# Altium project VM03_hv5.PrjPcb
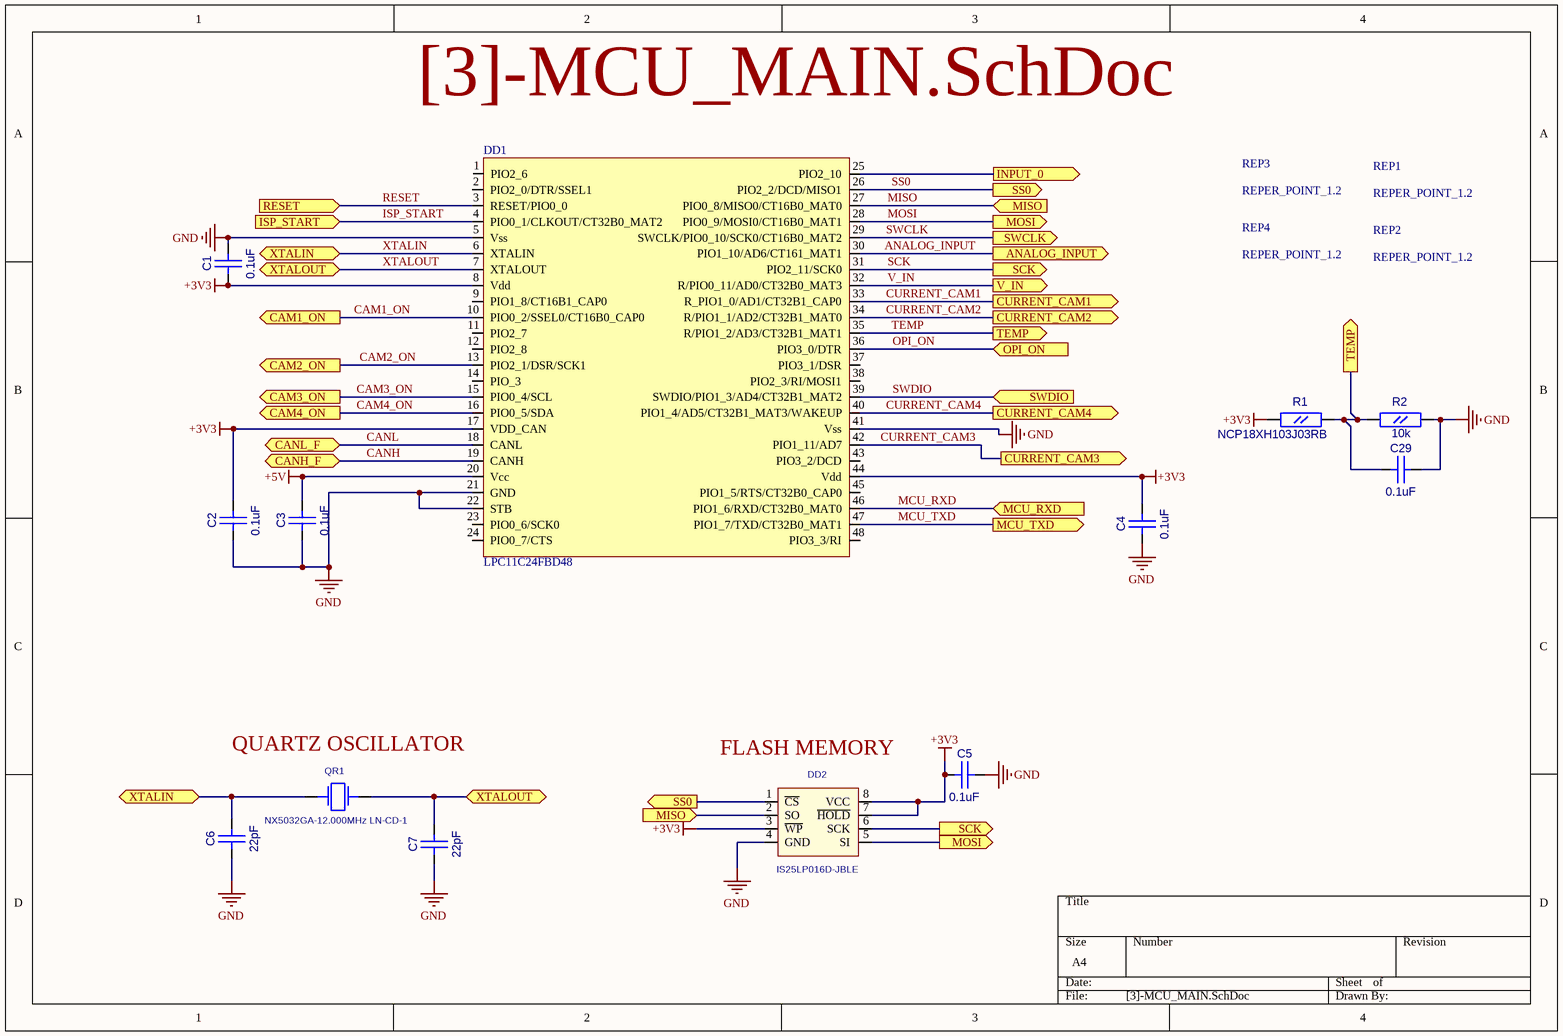
[diagram p0: [3]-MCU_MAIN.SchDoc]
7 sheets, 148 parts. Net scope: flat (ports and power ports of the same name join across sheets).
Board file: VM03_hv5.PcbDoc
Sheets:
  [3]-MCU_MAIN.SchDoc
  [6]-H3_MAIN.SchDoc
  [10]-MODEM_CONNECTORS.SchDoc
  [12]-CAMERA_POWER.SchDoc
  [16]-ETH_SWITCH.SchDoc
  [17]-ETH_CONNECTOR.SchDoc
  [19]-CAMERA_PWR_CONNECTORS.SchDoc

## Sheet [3]-MCU_MAIN.SchDoc
size A4

### Parts
C1  0.1uF  [CC0603]
C2  0.1uF  [CC0603]
C3  0.1uF  [CC0603]
C4  0.1uF  [CC0603]
C5  0.1uF  [CC0603]
C6  22pF  [CC0603]
C7  22pF  [CC0603]
C29  0.1uF  [CC0603]
DD1  LPC11C24FBD48  [LQFP48]
DD2  IS25LP016D-JBLE  [EIAJ_SO8]
QR1  NX5032GA-12.000MHz LN-CD-1  [AC5032_2]
R1  NCP18XH103J03RB  [RC0603]
R2  10k  [RC0603]
REP1  REPER_POINT_1.2  [REPER1.2]
REP2  REPER_POINT_1.2  [REPER1.2]
REP3  REPER_POINT_1.2  [REPER1.2]
REP4  REPER_POINT_1.2  [REPER1.2]

### Ports
ANALOG_INPUT (out), CAM1_ON (out), CAM2_ON (out), CAM3_ON (out), CAM4_ON (out), CANH_F (bidir), CANL_F (bidir), CURRENT_CAM1 (out), CURRENT_CAM2 (out), CURRENT_CAM3 (out), CURRENT_CAM4 (out), INPUT_0 (out), ISP_START (in), MCU_RXD (in), MCU_TXD (out), MISO (in), MOSI (out), OPI_ON (in), RESET (in), SCK (out), SS0 (out), SWCLK (out), SWDIO (in), TEMP (out), V_IN (out), XTALIN (bidir), XTALOUT (bidir)

### Nets
+3V3: C1.1(A) C2.2(B) C4.2(B) C5.1(A) DD1.8(Vdd) DD1.17(VDD_CAN) DD1.44(Vdd) DD2.3(~{WP}) DD2.7(~{HOLD}) DD2.8(VCC) R1.1(A)
+5V: C3.2(B) DD1.20(Vcc)
GND: C1.2(B) C2.1(A) C3.1(A) C4.1(A) C5.2(B) C6.1(A) C7.1(A) C29.2(B) DD1.5(Vss) DD1.21(GND) DD1.22(STB) DD1.41(Vss) DD2.4(GND) R2.2(B)
ANALOG_INPUT: DD1.30(PIO1_10/AD6/CT161_MAT1) ; port ANALOG_INPUT
CAM1_ON: DD1.10(PIO0_2/SSEL0/CT16B0_CAP0) ; port CAM1_ON
CAM2_ON: DD1.13(PIO2_1/DSR/SCK1) ; port CAM2_ON
CAM3_ON: DD1.15(PIO0_4/SCL) ; port CAM3_ON
CAM4_ON: DD1.16(PIO0_5/SDA) ; port CAM4_ON
CANH: DD1.19(CANH) ; port CANH_F
CANL: DD1.18(CANL) ; port CANL_F
CURRENT_CAM1: DD1.33(R_PIO1_0/AD1/CT32B1_CAP0) ; port CURRENT_CAM1
CURRENT_CAM2: DD1.34(R/PIO1_1/AD2/CT32B1_MAT0) ; port CURRENT_CAM2
CURRENT_CAM3: DD1.42(PIO1_11/AD7) ; port CURRENT_CAM3
CURRENT_CAM4: DD1.40(PIO1_4/AD5/CT32B1_MAT3/WAKEUP) ; port CURRENT_CAM4
INPUT_0: DD1.25(PIO2_10) ; port INPUT_0
ISP_START: DD1.4(PIO0_1/CLKOUT/CT32B0_MAT2) ; port ISP_START
MCU_RXD: DD1.46(PIO1_6/RXD/CT32B0_MAT0) ; port MCU_RXD
MCU_TXD: DD1.47(PIO1_7/TXD/CT32B0_MAT1) ; port MCU_TXD
MISO: DD1.27(PIO0_8/MISO0/CT16B0_MAT0) DD2.2(SO) ; port MISO
MOSI: DD1.28(PIO0_9/MOSI0/CT16B0_MAT1) DD2.5(SI) ; port MOSI
OPI_ON: DD1.36(PIO3_0/DTR) ; port OPI_ON
RESET: DD1.3(RESET/PIO0_0) ; port RESET
SCK: DD1.31(PIO2_11/SCK0) DD2.6(SCK) ; port SCK
SS0: DD1.26(PIO2_2/DCD/MISO1) DD2.1(~{CS}) ; port SS0
SWCLK: DD1.29(SWCLK/PIO0_10/SCK0/CT16B0_MAT2) ; port SWCLK
SWDIO: DD1.39(SWDIO/PIO1_3/AD4/CT32B1_MAT2) ; port SWDIO
TEMP: C29.1(A) DD1.35(R/PIO1_2/AD3/CT32B1_MAT1) R1.2(B) R2.1(A) ; port TEMP
V_IN: DD1.32(R/PIO0_11/AD0/CT32B0_MAT3) ; port V_IN
XTALIN: C6.2(B) DD1.6(XTALIN) QR1.1 ; port XTALIN
XTALOUT: C7.2(B) DD1.7(XTALOUT) QR1.2 ; port XTALOUT

Not connected (* = marked no-connect by the designer): DD1 1(PIO2_6) 2(PIO2_0/DTR/SSEL1) 9(PIO1_8/CT16B1_CAP0) 11(PIO2_7) 12(PIO2_8) 14(PIO_3) 23(PIO0_6/SCK0) 24(PIO0_7/CTS) 37(PIO3_1/DSR) 38(PIO2_3/RI/MOSI1) 43(PIO3_2/DCD) 45(PIO1_5/RTS/CT32B0_CAP0) 48(PIO3_3/RI); REP1 1; REP2 1; REP3 1; REP4 1

### Notes on the sheet
- (near QR1) QUARTZ OSCILLATOR
- (near DD2) FLASH MEMORY

### Library data of the parts
C1-C7 C29 = CC0603
  C1-C5 C29: Value: 0.1uF
  C6 C7: Value: 22pF
DD2 = S25FL016A0LMFI01: Value: IS25LP016D-JBLE
QR1 = AC5032_2: AC5032/2; Value: NX5032GA-12.000MHz LN-CD-1
R1 R2 = RC0603
  R1: Value: NCP18XH103J03RB
  R2: Value: 10k
REP1-REP4 = REPER1.2: Value: REPER_POINT_1.2
DD1 = LPC11C24FBD48: Value: LPC11C24FBD48

## Sheet [6]-H3_MAIN.SchDoc
size A4
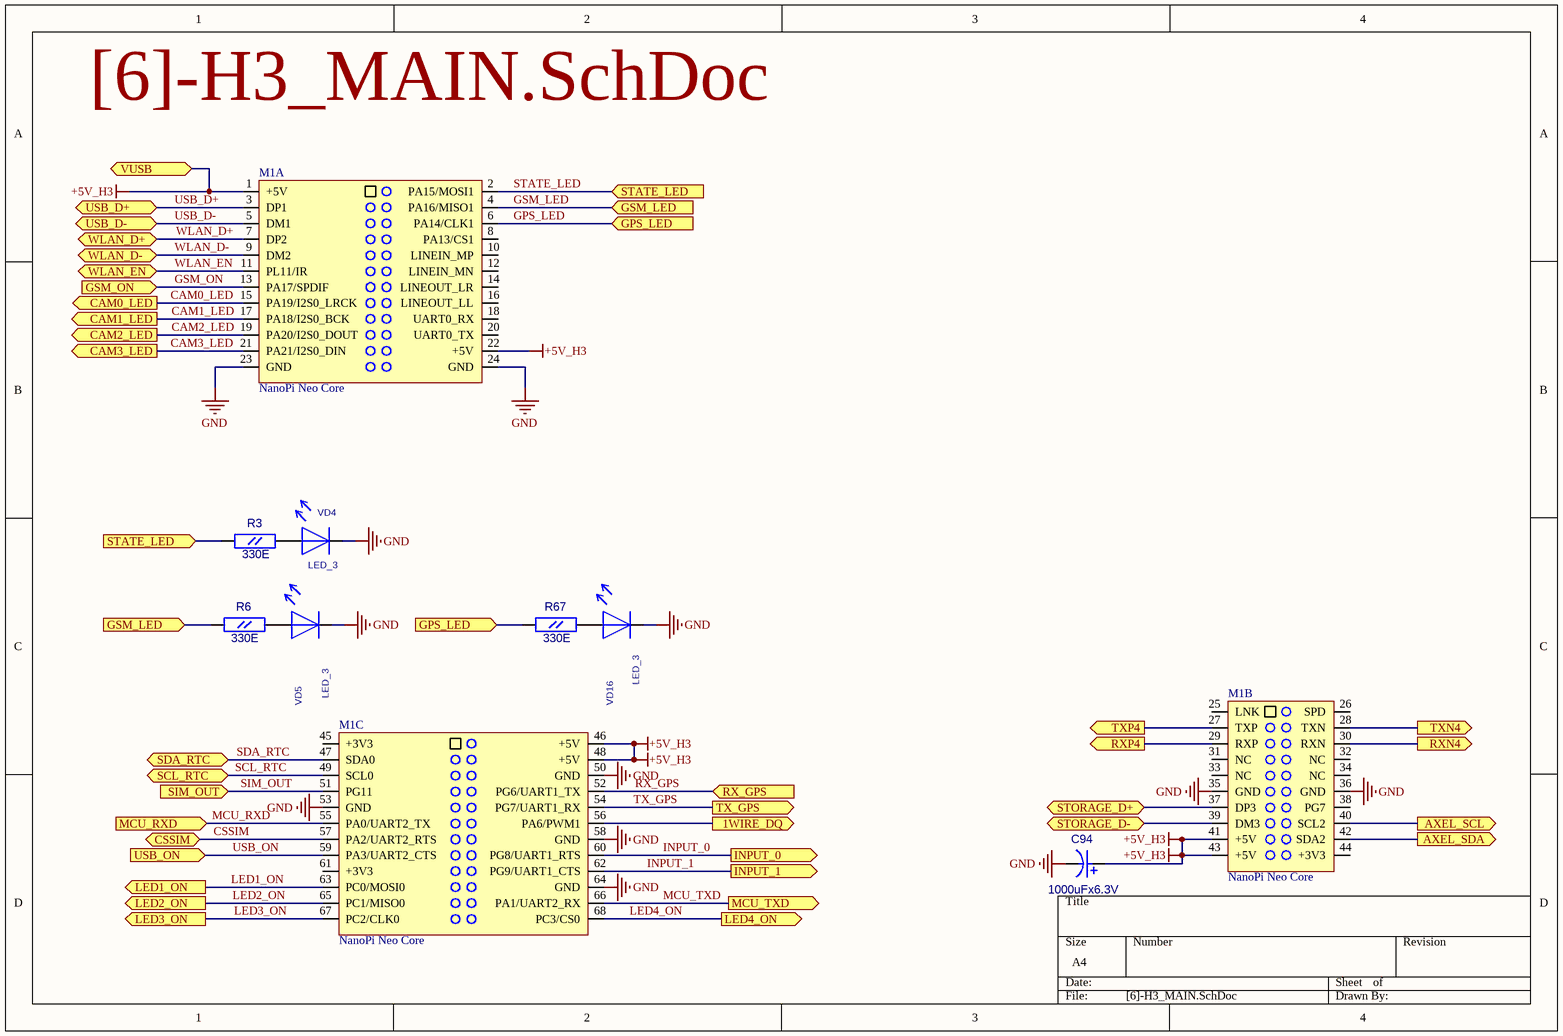
[diagram p1: [6]-H3_MAIN.SchDoc]

### Parts
C94  1000uFx6.3V  [CC8X3.5]
M1  NanoPi Neo Core  [NanoPiNeo_CORE]  (parts A,B,C of 3)
R3  330E  [RC0603]
R6  330E  [RC0603]
R67  330E  [RC0603]
VD4  LED_3  [LED3]
VD5  LED_3  [LED3]
VD16  LED_3  [LED3]

### Ports
1WIRE_DQ (out), AXEL_SCL (out), AXEL_SDA (out), CAM0_LED (out), CAM1_LED (out), CAM2_LED (out), CAM3_LED (out), CSSIM (bidir), GPS_LED (in), GSM_LED (in), GSM_ON (in), INPUT_0 (out), INPUT_1 (out), LED1_ON (out), LED2_ON (out), LED3_ON (out), LED4_ON (out), MCU_RXD (in), MCU_TXD (out), RX_GPS (in), RXN4 (out), RXP4 (out), SCL_RTC (bidir), SDA_RTC (bidir), SIM_OUT (in), STATE_LED (in), STORAGE_D+ (bidir), STORAGE_D- (bidir), TX_GPS (out), TXN4 (out), TXP4 (out), USB_D+ (bidir), USB_D- (bidir), USB_ON (in), VUSB (bidir), WLAN_D+ (bidir), WLAN_D- (bidir), WLAN_EN (bidir)

### Nets
+5V_H3: C94.1 M1.1(+5V) M1.22(+5V) M1.41(+5V) M1.43(+5V) M1.46(+5V) M1.48(+5V) ; port VUSB
GND: C94.2 M1.23(GND) M1.24(GND) M1.35(GND) M1.36(GND) M1.50(GND) M1.53(GND) M1.58(GND) M1.64(GND) VD4.1 VD5.1 VD16.1
CAM0_LED: M1.15(PA19/I2S0_LRCK) ; port CAM0_LED
CAM1_LED: M1.17(PA18/I2S0_BCK) ; port CAM1_LED
CAM2_LED: M1.19(PA20/I2S0_DOUT) ; port CAM2_LED
CAM3_LED: M1.21(PA21/I2S0_DIN) ; port CAM3_LED
CSSIM: M1.57(PA2/UART2_RTS) ; port CSSIM
GPS_LED: M1.6(PA14/CLK1) R67.1(A) ; port GPS_LED
GSM_LED: M1.4(PA16/MISO1) R6.1(A) ; port GSM_LED
GSM_ON: M1.13(PA17/SPDIF) ; port GSM_ON
INPUT_0: M1.60(PG8/UART1_RTS) ; port INPUT_0
INPUT_1: M1.62(PG9/UART1_CTS) ; port INPUT_1
LED1_ON: M1.63(PC0/MOSI0) ; port LED1_ON
LED2_ON: M1.65(PC1/MISO0) ; port LED2_ON
LED3_ON: M1.67(PC2/CLK0) ; port LED3_ON
LED4_ON: M1.68(PC3/CS0) ; port LED4_ON
MCU_RXD: M1.55(PA0/UART2_TX) ; port MCU_RXD
MCU_TXD: M1.66(PA1/UART2_RX) ; port MCU_TXD
RX_GPS: M1.52(PG6/UART1_TX) ; port RX_GPS
SCL_RTC: M1.49(SCL0) ; port SCL_RTC
SDA_RTC: M1.47(SDA0) ; port SDA_RTC
SIM_OUT: M1.51(PG11) ; port SIM_OUT
STATE_LED: M1.2(PA15/MOSI1) R3.1(A) ; port STATE_LED
TX_GPS: M1.54(PG7/UART1_RX) ; port TX_GPS
USB_D+: M1.3(DP1) ; port USB_D+
USB_D-: M1.5(DM1) ; port USB_D-
USB_ON: M1.59(PA3/UART2_CTS) ; port USB_ON
WLAN_D+: M1.7(DP2) ; port WLAN_D+
WLAN_D-: M1.9(DM2) ; port WLAN_D-
WLAN_EN: M1.11(PL11/IR) ; port WLAN_EN
NetDD4_19: M1.27(TXP) ; port TXP4
NetDD4_20: M1.28(TXN) ; port TXN4
NetDD4_21: M1.30(RXN) ; port RXN4
NetDD4_22: M1.29(RXP) ; port RXP4
NetM1_37: M1.37(DP3) ; port STORAGE_D+
NetM1_39: M1.39(DM3) ; port STORAGE_D-
NetM1_40: M1.40(SCL2) ; port AXEL_SCL
NetM1_42: M1.42(SDA2) ; port AXEL_SDA
NetM1_56: M1.56(PA6/PWM1) ; port 1WIRE_DQ
NetR3_2: R3.2(B) VD4.2
NetR6_2: R6.2(B) VD5.2
NetR67_2: R67.2(B) VD16.2

Not connected (* = marked no-connect by the designer): M1 8(PA13/CS1) 10(LINEIN_MP) 12(LINEIN_MN) 14(LINEOUT_LR) 16(LINEOUT_LL) 18(UART0_RX) 20(UART0_TX) 25(LNK) 26(SPD) 31(NC) 32(NC) 33(NC) 34(NC) 38(PG7) 44(+3V3) 45(+3V3) 61(+3V3)

### Library data of the parts
C94 = CAP_8mm: Radial capacitor; Value: 1000uFx6.3V
M1 = NanoPi Neo Core: Nano Pi Neo Core Allwinner H3 based embedded module; Value: NanoPi Neo Core
R3 R6 R67 = RC0603: Value: 330E
VD4 VD5 VD16 = LED_3: Value: *

## Sheet [10]-MODEM_CONNECTORS.SchDoc
size A4
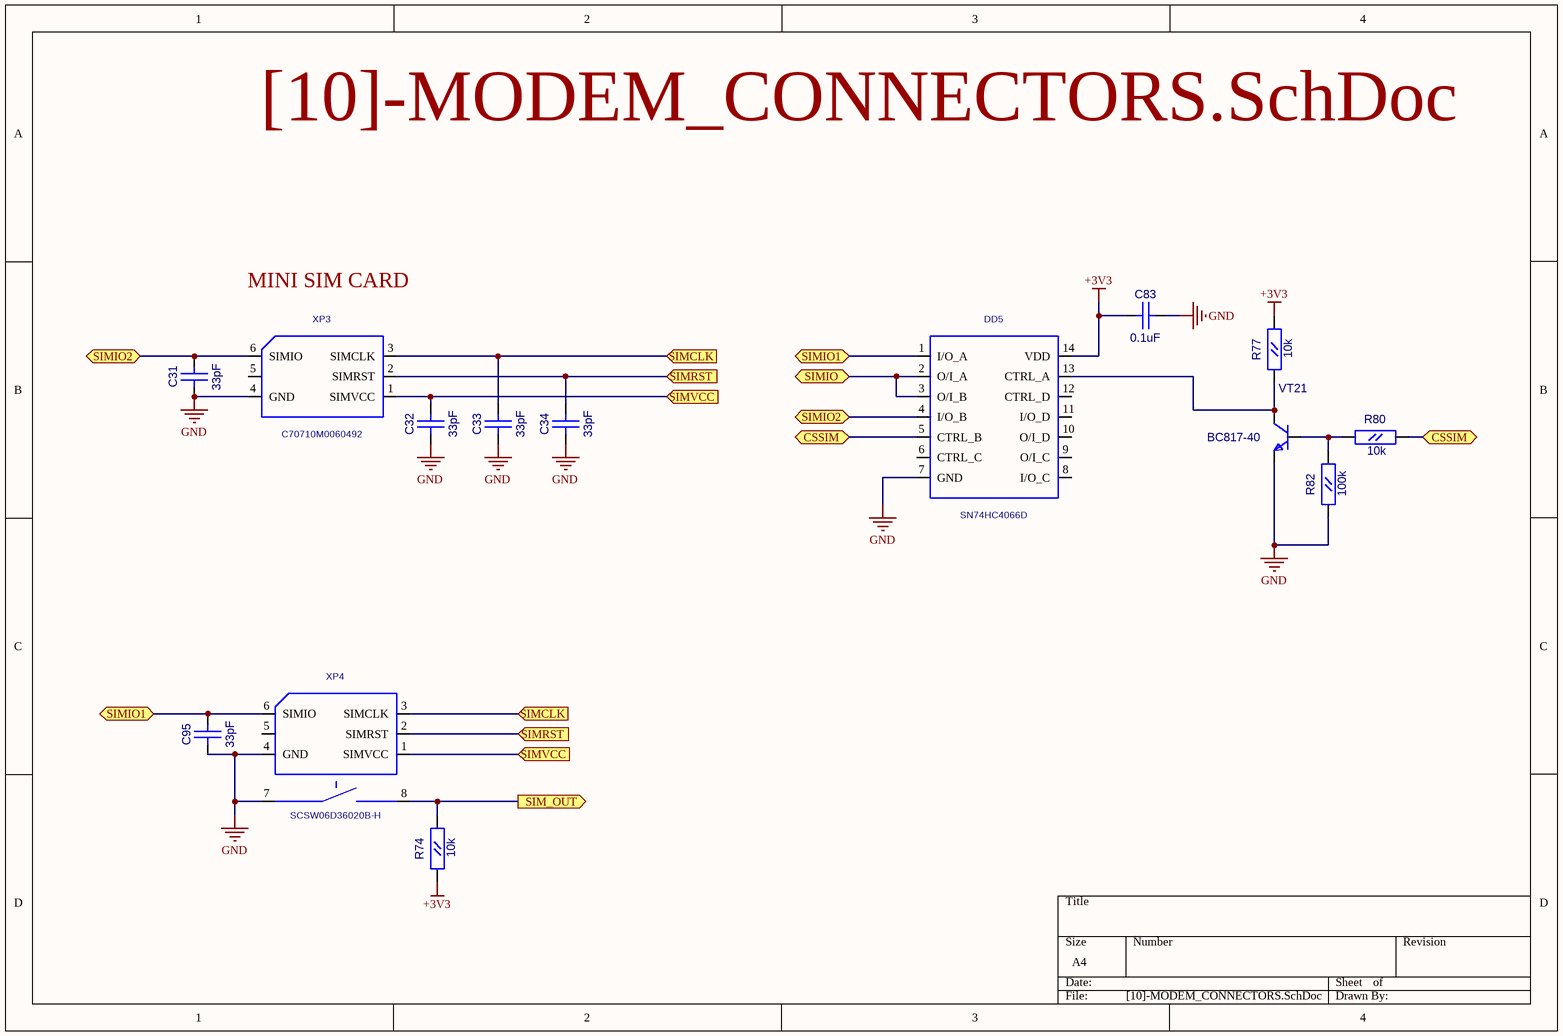
[diagram p2: [10]-MODEM_CONNECTORS.SchDoc]

### Parts
C31  33pF  [CC0603]
C32  33pF  [CC0603]
C33  33pF  [CC0603]
C34  33pF  [CC0603]
C83  0.1uF  [CC0603]
C95  33pF  [CC0603]
DD5  SN74HC4066D  [SO14]
R74  10k  [RC0603]
R77  10k  [RC0603]
R80  10k  [RC0603]
R82  100k  [RC0603]
VT21  BC817-40  [SOT-23(123)]
XP3  C70710M0060492  [SCVW06A25020]
XP4  SCSW06D36020B-H  [SCSW06D36020B-H]

### Ports
CSSIM (bidir), SIM_OUT (out), SIMCLK (in), SIMIO1 (bidir), SIMIO2 (bidir), SIMIO (bidir), SIMRST (in), SIMVCC (in)

### Nets
+3V3: C83.1(A) DD5.14(VDD) R74.1(A) R77.2(B)
GND: C31.1(A) C32.1(A) C33.1(A) C34.1(A) C83.2(B) C95.1(A) DD5.7(GND) R82.1(A) VT21.2(E) XP3.4(GND) XP4.4(GND) XP4.7
CSSIM: DD5.5(CTRL_B) R80.2(B) ; port CSSIM
SIM_OUT: R74.2(B) XP4.8 ; port SIM_OUT
NetC31_2: C31.2(B) DD5.4(I/O_B) XP3.6(SIMIO) ; port SIMIO2
NetC32_2: C32.2(B) XP3.1(SIMVCC) XP4.1(SIMVCC) ; port SIMVCC
NetC33_2: C33.2(B) XP3.3(SIMCLK) XP4.3(SIMCLK) ; port SIMCLK
NetC34_2: C34.2(B) XP3.2(SIMRST) XP4.2(SIMRST) ; port SIMRST
NetC95_2: C95.2(B) DD5.1(I/O_A) XP4.6(SIMIO) ; port SIMIO1
NetDD5_2: DD5.2(O/I_A) DD5.3(O/I_B) ; port SIMIO
NetDD5_13: DD5.13(CTRL_A) R77.1(A) VT21.3(C)
NetR80_1: R80.1(A) R82.2(B) VT21.1(B)

Not connected (* = marked no-connect by the designer): DD5 6(CTRL_C) 8(I/O_C) 9(O/I_C) 10(O/I_D) 11(I/O_D) 12(CTRL_D); XP3 5; XP4 5

### Notes on the sheet
- MINI SIM CARD

### Library data of the parts
C31-C34 C83 C95 = CC0603
  C31-C34 C95: Value: 33pF
  C83: Value: 0.1uF
R74 R77 R80 R82 = RC0603
  R74 R77 R80: Value: 10k
  R82: Value: 100k
VT21 = BC846BLT1: NPN 500ma transistor; ComponentField7: Published 29-Sep-2000; OriginalName: BC846BLT1; Value: BC817-40
XP3 = SCV-W06A25-020: Value: *
DD5 = SN74HC4066D: Value: *
XP4 = SCSW06D36020B-H: Value: *

## Sheet [12]-CAMERA_POWER.SchDoc
size A4
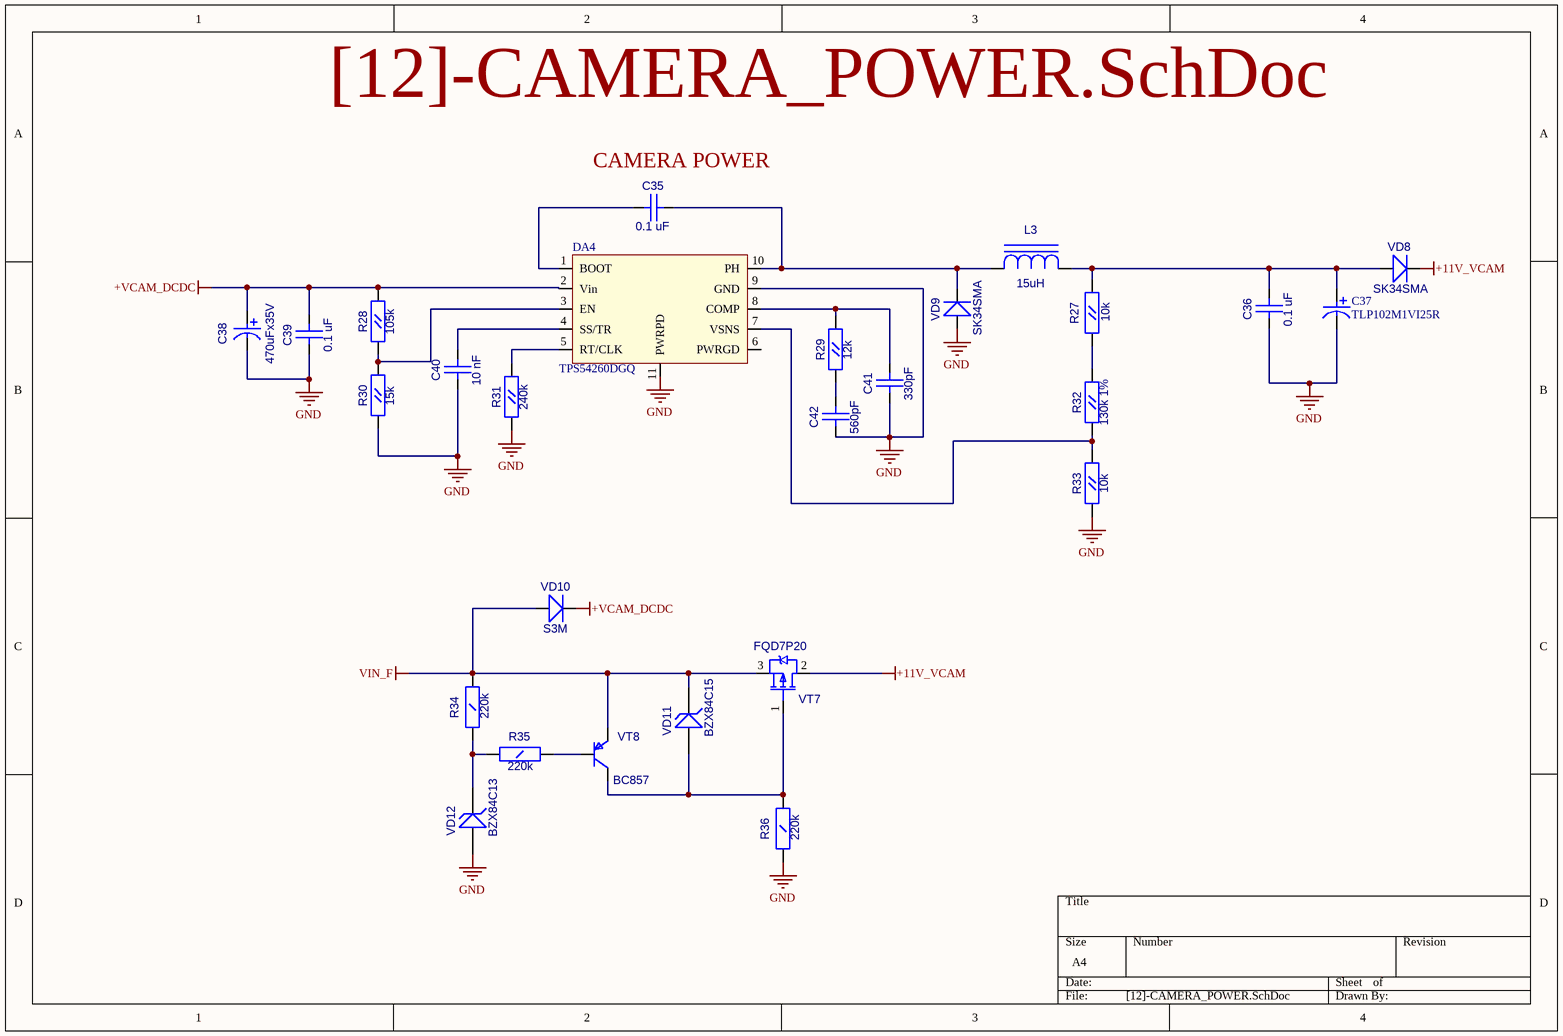
[diagram p3: [12]-CAMERA_POWER.SchDoc]

### Parts
C35  0.1 uF  [CC0603]
C36  0.1 uF  [CC0603]
C37  TLP102M1VI25R  [CAP_13x26]
C38  470uFx35V  [CC16X10_CAP0.5(1)(Primary)]
C39  0.1 uF  [CC0603]
C40  10 nF  [CC0603]
C41  330pF  [CC0603]
C42  560pF  [CC0603]
DA4  TPS54260DGQ  [S-PDSO-G10]
L3  15uH  [SDR0805]
R27  10k  [RC0603]
R28  105k  [RC0603]
R29  12k  [RC0603]
R30  15k  [RC0603]
R31  240k  [RC0603]
R32  130k 1%  [RC0603]
R33  10k  [RC0603]
R34  220k  [RC1206]
R35  220k  [RC1206]
R36  220k  [RC1206]
VD8  SK34SMA  [SMA]
VD9  SK34SMA  [SMA]
VD10  S3M  [SMC]
VD11  BZX84C15  [SOT-23(123)]
VD12  BZX84C13  [SOT-23(123)]
VT7  FQD7P20  [D-PAK(TO-252AA)]
VT8  BC857  [SOT-23(123)]

### Nets
+11V_VCAM: VD8.2(K) VT7.2(D)
+VCAM_DCDC: C38.2 C39.1(A) DA4.2(Vin) R28.2(B) VD10.2(K)
GND: C36.2(B) C37.1 C38.1 C39.2(B) C40.2(B) C41.2(B) C42.2(B) DA4.9(GND) DA4.11(PWRPD) R30.1(A) R31.1(A) R33.1(A) R36.1(A) VD9.1(A) VD12.1(A)
VIN_F: R34.2(B) VD10.1(A) VD11.3(K) VT7.3(S) VT8.2(E)
NetC35_1: C35.1(A) DA4.10(PH) L3.1(C) VD9.2(K)
NetC35_2: C35.2(B) DA4.1(BOOT)
NetC36_1: C36.1(A) C37.2 L3.2(A) R27.2(B) VD8.1(A)
NetC40_1: C40.1(A) DA4.4(SS/TR)
NetC41_1: C41.1(A) DA4.8(COMP) R29.2(B)
NetC42_1: C42.1(A) R29.1(A)
NetDA4_3: DA4.3(EN) R28.1(A) R30.2(B)
NetDA4_5: DA4.5(RT/CLK) R31.2(B)
NetDA4_7: DA4.7(VSNS) R32.1(A) R33.2(B)
NetR27_1: R27.1(A) R32.2(B)
NetR34_1: R34.1(A) R35.1(A) VD12.3(K)
NetR35_2: R35.2(B) VT8.1(B)
NetR36_2: R36.2(B) VD11.1(A) VT7.1(G) VT8.3(C)

Not connected (* = marked no-connect by the designer): DA4 6(PWRGD)

### Notes on the sheet
- (near C35) CAMERA POWER

### Library data of the parts
C35 C36 C39-C42 = CC0603
  C35 C36 C39: Value: 0.1 uF
  C40: Value: 10 nF
  C41: Value: 330pF
  C42: Value: 560pF
C37 = SUPERCAP_10F: Value: TLP102M1VI25R
C38 = CAP0.5(1): Value: 470uFx35V
L3 = SDR0805: Value: 15uH
R27-R33 = RC0603
  R27 R33: Value: 10k
  R28: Value: 105k
  R29: Value: 12k
  R30: Value: 15k
  R31: Value: 240k
  R32: Value: 130k 1%
R34-R36 = RC1206: Value: 220k
VD8 VD9 = SK34SMA: Schottky Rectifier; Value: {Value}
VD10 = S3A: Schottky Rectifier; Value: S3M
VD11 VD12 = BZX84: Zener Voltage Regulator Diode
  VD11: Value: BZX84C15
  VD12: Value: BZX84C13
VT7 = IRFR9220: HEXFET Power MOSFET; OriginalName: IRLML5103; ComponentField7: Published 8-Jun-2000; Value: FQD7P20
VT8 = BC857B: PNP 100ma transistor; OriginalName: BC846BLT1; ComponentField7: Published 29-Sep-2000; Value: BC857

## Sheet [16]-ETH_SWITCH.SchDoc
size A4
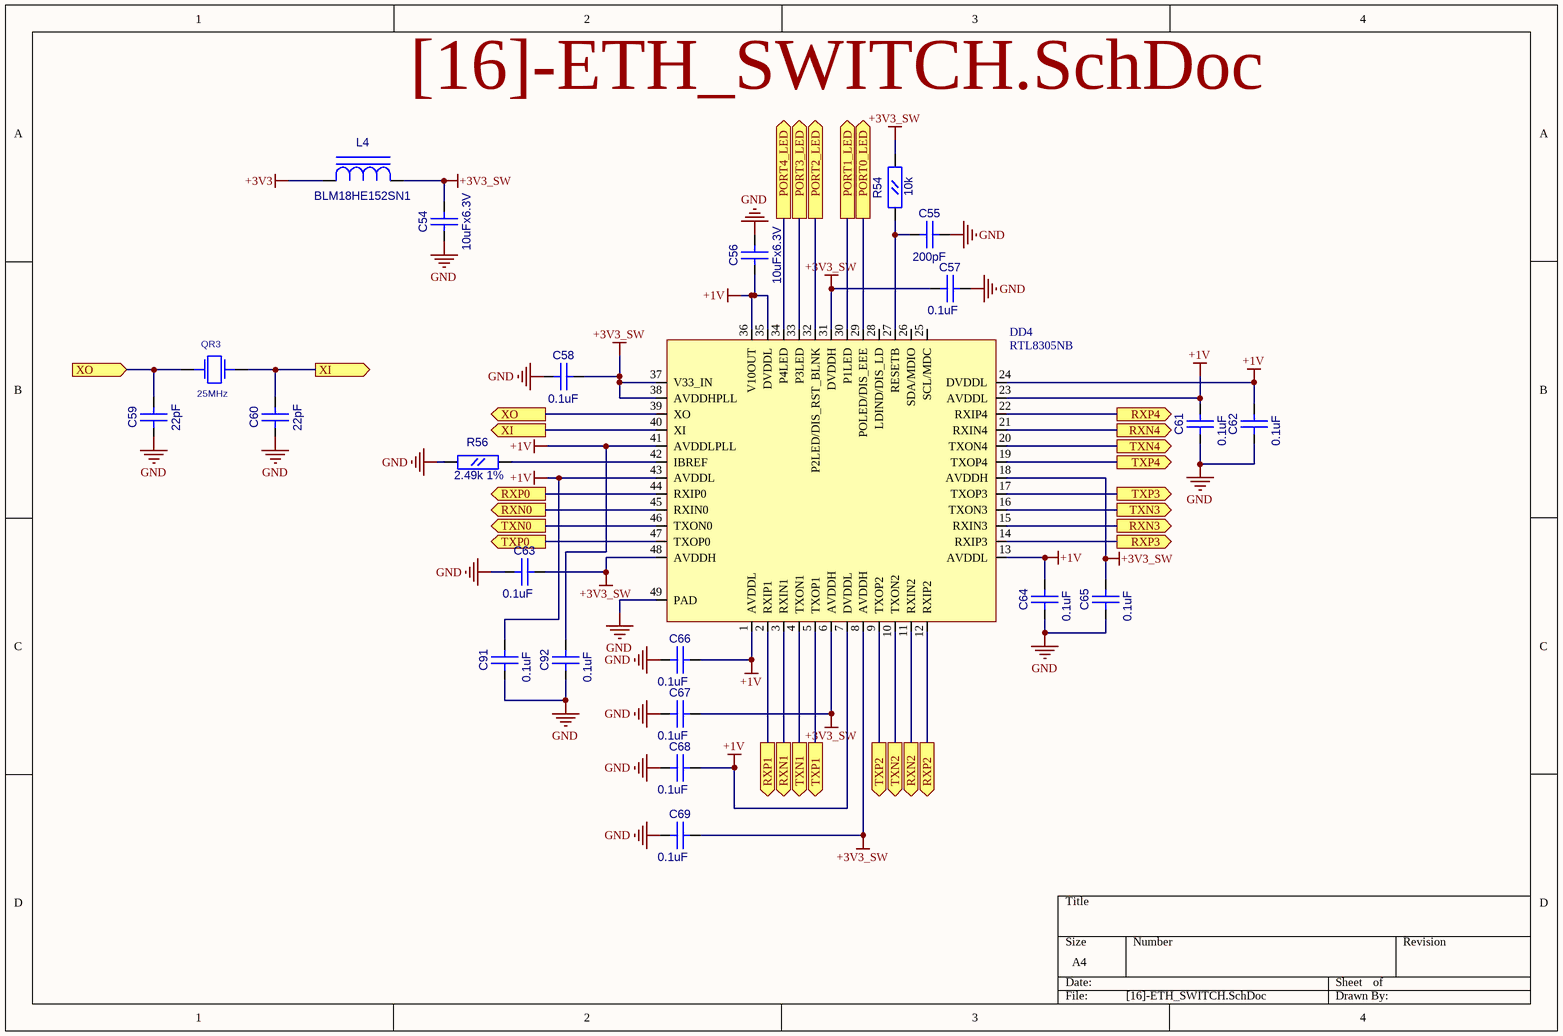
[diagram p4: [16]-ETH_SWITCH.SchDoc]

### Parts
C54  10uFx6.3V  [CC0805]
C55  200pF  [CC0603]
C56  10uFx6.3V  [CC0805]
C57  0.1uF  [CC0603]
C58  0.1uF  [CC0603]
C59  22pF  [CC0603]
C60  22pF  [CC0603]
C61  0.1uF  [CC0603]
C62  0.1uF  [CC0603]
C63  0.1uF  [CC0603]
C64  0.1uF  [CC0603]
C65  0.1uF  [CC0603]
C66  0.1uF  [CC0603]
C67  0.1uF  [CC0603]
C68  0.1uF  [CC0603]
C69  0.1uF  [CC0603]
C91  0.1uF  [CC0603]
C92  0.1uF  [CC0603]
DD4  RTL8305NB  [QFN48_ISL]
L4  BLM18HE152SN1  [L0603]
QR3  25MHz  [AC5032_2]
R54  10k  [RC0603]
R56  2.49k 1%  [RC0603]

### Ports
PORT0_LED (out), PORT1_LED (out), PORT2_LED (out), PORT3_LED (out), PORT4_LED (out), RXN0 (out), RXN1 (out), RXN2 (out), RXN3 (out), RXN4 (out), RXP0 (out), RXP1 (out), RXP2 (out), RXP3 (out), RXP4 (out), TXN0 (out), TXN1 (out), TXN2 (out), TXN3 (out), TXN4 (out), TXP0 (out), TXP1 (out), TXP2 (out), TXP3 (out), TXP4 (out), XI (out), XO (in), XO (out)

### Nets
+1V: C56.1(A) C61.2(B) C62.2(B) C64.2(B) C66.2(B) C68.2(B) C91.2(B) C92.2(B) DD4.1(AVDDL) DD4.7(DVDDL) DD4.13(AVDDL) DD4.23(AVDDL) DD4.24(DVDDL) DD4.35(DVDDL) DD4.36(V10OUT) DD4.41(AVDDLPLL) DD4.43(AVDDL)
+3V3: L4.1(A)
+3V3_SW: C54.2(B) C57.1(A) C58.2(B) C63.2(B) C65.2(B) C67.2(B) C69.2(B) DD4.6(AVDDH) DD4.8(AVDDH) DD4.18(AVDDH) DD4.31(DVDDH) DD4.37(V33_IN) DD4.38(AVDDHPLL) DD4.48(AVDDH) L4.2(C) R54.2(B)
GND: C54.1(A) C55.2(B) C56.2(B) C57.2(B) C58.1(A) C59.1(A) C60.1(A) C61.1(A) C62.1(A) C63.1(A) C64.1(A) C65.1(A) C66.1(A) C67.1(A) C68.1(A) C69.1(A) C91.1(A) C92.1(A) DD4.49(PAD) R56.1(A)
NetC55_1: C55.1(A) DD4.27(RESETB) R54.1(A)
NetC59_2: C59.2(B) DD4.39(XO) QR3.1 ; port XO
NetC60_2: C60.2(B) DD4.40(XI) QR3.2 ; port XI
NetDD4_2: DD4.2(RXIP1) ; port RXP1
NetDD4_3: DD4.3(RXIN1) ; port RXN1
NetDD4_4: DD4.4(TXON1) ; port TXN1
NetDD4_5: DD4.5(TXOP1) ; port TXP1
NetDD4_9: DD4.9(TXOP2) ; port TXP2
NetDD4_10: DD4.10(TXON2) ; port TXN2
NetDD4_11: DD4.11(RXIN2) ; port RXN2
NetDD4_12: DD4.12(RXIP2) ; port RXP2
NetDD4_14: DD4.14(RXIP3) ; port RXP3
NetDD4_15: DD4.15(RXIN3) ; port RXN3
NetDD4_16: DD4.16(TXON3) ; port TXN3
NetDD4_17: DD4.17(TXOP3) ; port TXP3
NetDD4_19: DD4.19(TXOP4) ; port TXP4
NetDD4_20: DD4.20(TXON4) ; port TXN4
NetDD4_21: DD4.21(RXIN4) ; port RXN4
NetDD4_22: DD4.22(RXIP4) ; port RXP4
NetDD4_29: DD4.29(POLED/DIS_EEE) ; port PORT0_LED
NetDD4_30: DD4.30(P1LED) ; port PORT1_LED
NetDD4_32: DD4.32(P2LED/DIS_RST_BLNK) ; port PORT2_LED
NetDD4_33: DD4.33(P3LED) ; port PORT3_LED
NetDD4_34: DD4.34(P4LED) ; port PORT4_LED
NetDD4_42: DD4.42(IBREF) R56.2(B)
NetDD4_44: DD4.44(RXIP0) ; port RXP0
NetDD4_45: DD4.45(RXIN0) ; port RXN0
NetDD4_46: DD4.46(TXON0) ; port TXN0
NetDD4_47: DD4.47(TXOP0) ; port TXP0

Not connected (* = marked no-connect by the designer): DD4 25(SCL/MDC) 26(SDA/MDIO) 28(LDIND/DIS_LD)

### Library data of the parts
C54 C56 = CC0805: Value: 10uFx6.3V
C55 C57-C69 C91 C92 = CC0603
  C55: Value: 200pF
  C57 C58 C61-C69 C91 C92: Value: 0.1uF
  C59 C60: Value: 22pF
L4 = L0603: Value: BLM18HE152SN1
QR3 = AC5032_2: AC5032/2; Value: 25MHz
R54 R56 = RC0603
  R54: Value: 10k
  R56: Value: 2.49k 1%
DD4 = RTL8305NB: Value: RTL8305NB

## Sheet [17]-ETH_CONNECTOR.SchDoc
size A4
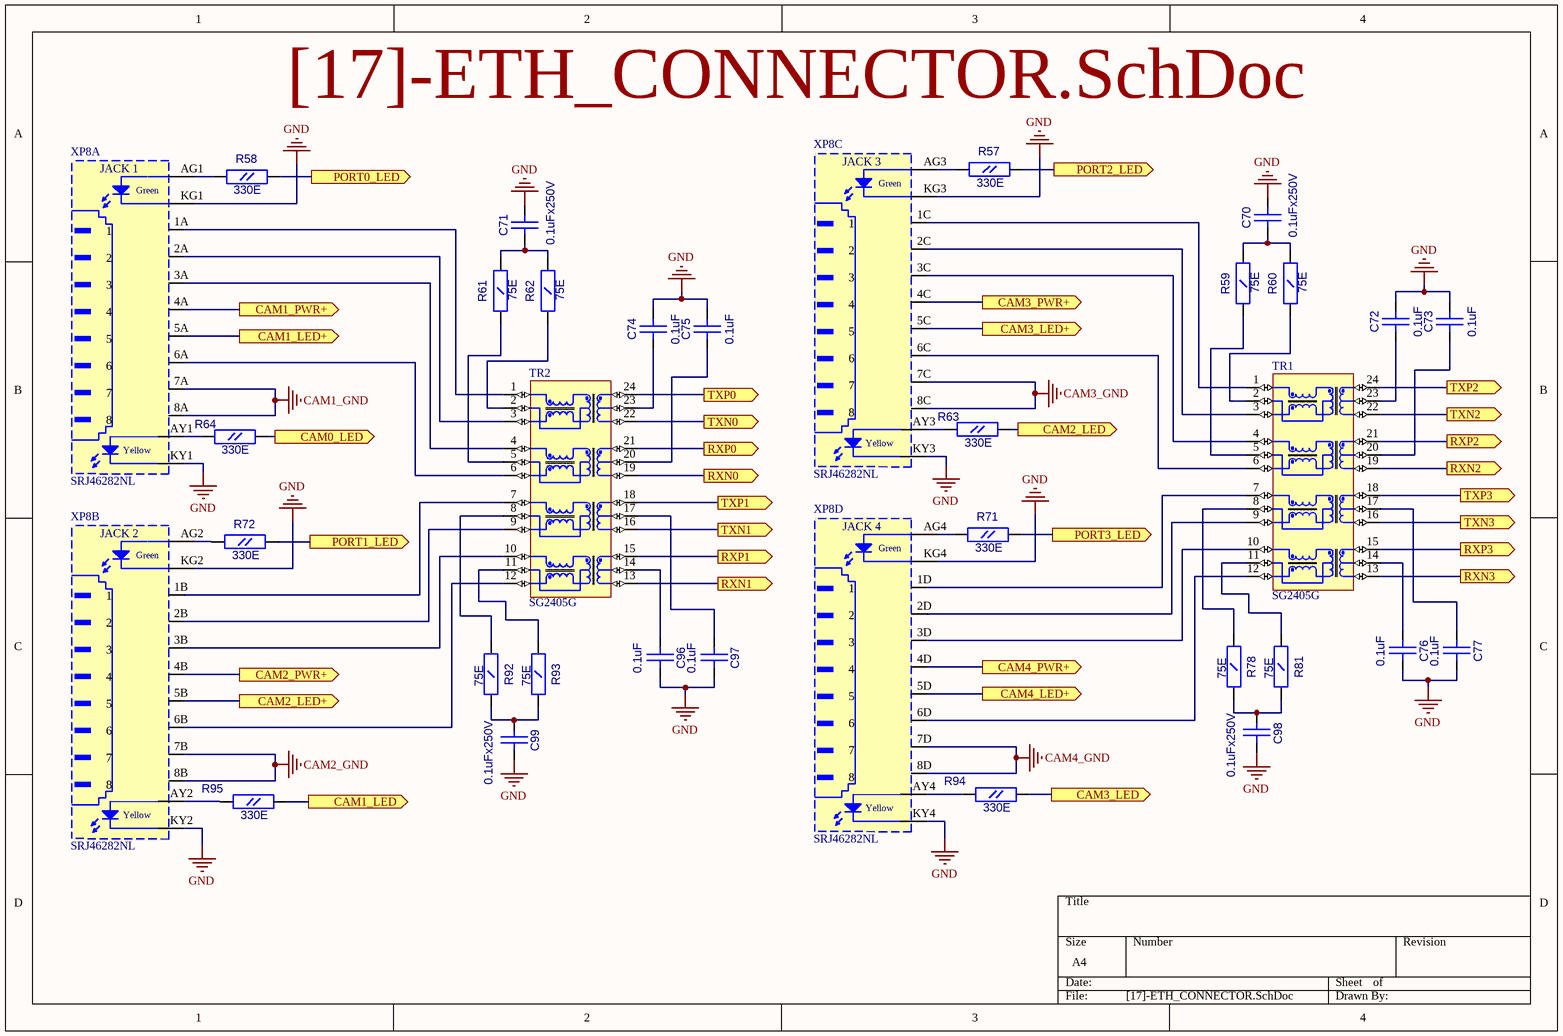
[diagram p5: [17]-ETH_CONNECTOR.SchDoc]

### Parts
C70  0.1uFx250V  [CC1206]
C71  0.1uFx250V  [CC1206]
C72  0.1uF  [CC0603]
C73  0.1uF  [CC0603]
C74  0.1uF  [CC0603]
C75  0.1uF  [CC0603]
C76  0.1uF  [CC0603]
C77  0.1uF  [CC0603]
C96  0.1uF  [CC0603]
C97  0.1uF  [CC0603]
C98  0.1uFx250V  [CC1206]
C99  0.1uFx250V  [CC1206]
R57  330E  [RC0603]
R58  330E  [RC0603]
R59  75E  [RC1206]
R60  75E  [RC1206]
R61  75E  [RC1206]
R62  75E  [RC1206]
R63  330E  [RC0603]
R64  330E  [RC0603]
R71  330E  [RC0603]
R72  330E  [RC0603]
R78  75E  [RC1206]
R81  75E  [RC1206]
R92  75E  [RC1206]
R93  75E  [RC1206]
R94  330E  [RC0603]
R95  330E  [RC0603]
TR1  SG2405G  [SG2405G]
TR2  SG2405G  [SG2405G]
XP8  SRJ46282NL  [SRJ46282NL]  (parts A,B,C,D of 4)

### Ports
CAM0_LED (out), CAM1_LED (out), CAM1_LED+ (out), CAM1_PWR+ (out), CAM2_LED (out), CAM2_LED+ (out), CAM2_PWR+ (out), CAM3_LED (out), CAM3_LED+ (out), CAM3_PWR+ (out), CAM4_LED+ (out), CAM4_PWR+ (out), PORT0_LED (out), PORT1_LED (out), PORT2_LED (out), PORT3_LED (out), RXN0 (out), RXN1 (out), RXN2 (out), RXN3 (out), RXP0 (out), RXP1 (out), RXP2 (out), RXP3 (out), TXN0 (out), TXN1 (out), TXN2 (out), TXN3 (out), TXP0 (out), TXP1 (out), TXP2 (out), TXP3 (out)

### Nets
CAM1_GND: XP8.7A XP8.8A
CAM2_GND: XP8.7B XP8.8B
CAM3_GND: XP8.7C XP8.8C
CAM4_GND: XP8.7D XP8.8D
GND: C70.2(B) C71.2(B) C72.2(B) C73.2(B) C74.2(B) C75.2(B) C76.2(B) C77.2(B) C96.2(B) C97.2(B) C98.2(B) C99.2(B) XP8.KG1(D2) XP8.KG2(D2) XP8.KG3(D2) XP8.KG4(D2) XP8.KY1(D4) XP8.KY2(D4) XP8.KY3(D4) XP8.KY4(D4)
CAM0_LED: R64.2(B) ; port CAM0_LED
CAM1_LED: R95.2(B) ; port CAM1_LED
CAM2_LED: R63.2(B) ; port CAM2_LED
CAM3_LED: R94.2(B) ; port CAM3_LED
NetC70_1: C70.1(A) R59.2(B) R60.2(B)
NetC71_1: C71.1(A) R61.2(B) R62.2(B)
NetC72_1: C72.1(A) TR1.23(RXCT1)
NetC73_1: C73.1(A) TR1.20(TXCT1)
NetC74_1: C74.1(A) TR2.23(RXCT1)
NetC75_1: C75.1(A) TR2.20(TXCT1)
NetC76_1: C76.1(A) TR1.14(RXCT2)
NetC77_1: C77.1(A) TR1.17(TXCT2)
NetC96_1: C96.1(A) TR2.14(RXCT2)
NetC97_1: C97.1(A) TR2.17(TXCT2)
NetC98_1: C98.1(A) R78.2(B) R81.2(B)
NetC99_1: C99.1(A) R92.2(B) R93.2(B)
NetDD4_2: TR2.15(RX2+) ; port RXP1
NetDD4_3: TR2.13(RX2-) ; port RXN1
NetDD4_4: TR2.16(TX2-) ; port TXN1
NetDD4_5: TR2.18(TX2+) ; port TXP1
NetDD4_9: TR1.24(RX1+) ; port TXP2
NetDD4_10: TR1.22(RX1-) ; port TXN2
NetDD4_11: TR1.19(TX1-) ; port RXN2
NetDD4_12: TR1.21(TX1+) ; port RXP2
NetDD4_14: TR1.15(RX2+) ; port RXP3
NetDD4_15: TR1.13(RX2-) ; port RXN3
NetDD4_16: TR1.16(TX2-) ; port TXN3
NetDD4_17: TR1.18(TX2+) ; port TXP3
NetDD4_29: R58.2(B) ; port PORT0_LED
NetDD4_30: R72.2(B) ; port PORT1_LED
NetDD4_32: R57.2(B) ; port PORT2_LED
NetDD4_33: R71.2(B) ; port PORT3_LED
NetDD4_44: TR2.21(TX1+) ; port RXP0
NetDD4_45: TR2.19(TX1-) ; port RXN0
NetDD4_46: TR2.22(RX1-) ; port TXN0
NetDD4_47: TR2.24(RX1+) ; port TXP0
NetR57_1: R57.1(A) XP8.AG3(D1)
NetR58_1: R58.1(A) XP8.AG1(D1)
NetR59_1: R59.1(A) TR1.5(TCT1)
NetR60_1: R60.1(A) TR1.2(RCT1)
NetR61_1: R61.1(A) TR2.5(TCT1)
NetR62_1: R62.1(A) TR2.2(RCT1)
NetR63_1: R63.1(A) XP8.AY3(D3)
NetR64_1: R64.1(A) XP8.AY1(D3)
NetR71_1: R71.1(A) XP8.AG4(D1)
NetR72_1: R72.1(A) XP8.AG2(D1)
NetR78_1: R78.1(A) TR1.8(TCT2)
NetR81_1: R81.1(A) TR1.11(RCT2)
NetR92_1: R92.1(A) TR2.8(TCT2)
NetR93_1: R93.1(A) TR2.11(RCT2)
NetR94_1: R94.1(A) XP8.AY4(D3)
NetR95_1: R95.1(A) XP8.AY2(D3)
NetTR1_1: TR1.1(RD1+) XP8.1C
NetTR1_3: TR1.3(RD1-) XP8.2C
NetTR1_4: TR1.4(TD1+) XP8.3C
NetTR1_6: TR1.6(TD1-) XP8.6C
NetTR1_7: TR1.7(TD2+) XP8.1D
NetTR1_9: TR1.9(TD2-) XP8.2D
NetTR1_10: TR1.10(RD2+) XP8.3D
NetTR1_12: TR1.12(RD2-) XP8.6D
NetTR2_1: TR2.1(RD1+) XP8.1A
NetTR2_3: TR2.3(RD1-) XP8.2A
NetTR2_4: TR2.4(TD1+) XP8.3A
NetTR2_6: TR2.6(TD1-) XP8.6A
NetTR2_7: TR2.7(TD2+) XP8.1B
NetTR2_9: TR2.9(TD2-) XP8.2B
NetTR2_10: TR2.10(RD2+) XP8.3B
NetTR2_12: TR2.12(RD2-) XP8.6B
NetVT11_5: XP8.5A ; port CAM1_LED+
NetVT11_7: XP8.4A ; port CAM1_PWR+
NetVT12_5: XP8.5C ; port CAM3_LED+
NetVT12_7: XP8.4C ; port CAM3_PWR+
NetVT13_5: XP8.5D ; port CAM4_LED+
NetVT13_7: XP8.4D ; port CAM4_PWR+
NetVT23_5: XP8.5B ; port CAM2_LED+
NetVT23_7: XP8.4B ; port CAM2_PWR+

### Notes on the sheet
- (in symbol SRJ46282NL, part A) JACK 1; Green; 2; 3; 4; 5; 6; 7; 8; Yellow
- (in symbol SRJ46282NL, part B) JACK 2; Green; 2; 3; 4; 5; 6; 7; 8; Yellow
- (in symbol SRJ46282NL, part C) JACK 3; Green; 2; 3; 4; 5; 6; 7; 8; Yellow
- (in symbol SRJ46282NL, part D) JACK 4; Green; 2; 3; 4; 5; 6; 7; 8; Yellow

### Library data of the parts
C70 C71 C98 C99 = CC1206: Value: 0.1uFx250V
C72-C77 C96 C97 = CC0603: Value: 0.1uF
R57 R58 R63 R64 R71 R72 R94 R95 = RC0603: Value: 330E
R59-R62 R78 R81 R92 R93 = RC1206: Value: 75E
TR1 TR2 = SG2405G: Ehternet transformer Gigabit or 2 LAN10/100; Value: SG2405G
XP8 = SRJ46282NL: Value: SRJ46282NL

## Sheet [19]-CAMERA_PWR_CONNECTORS.SchDoc
size A4
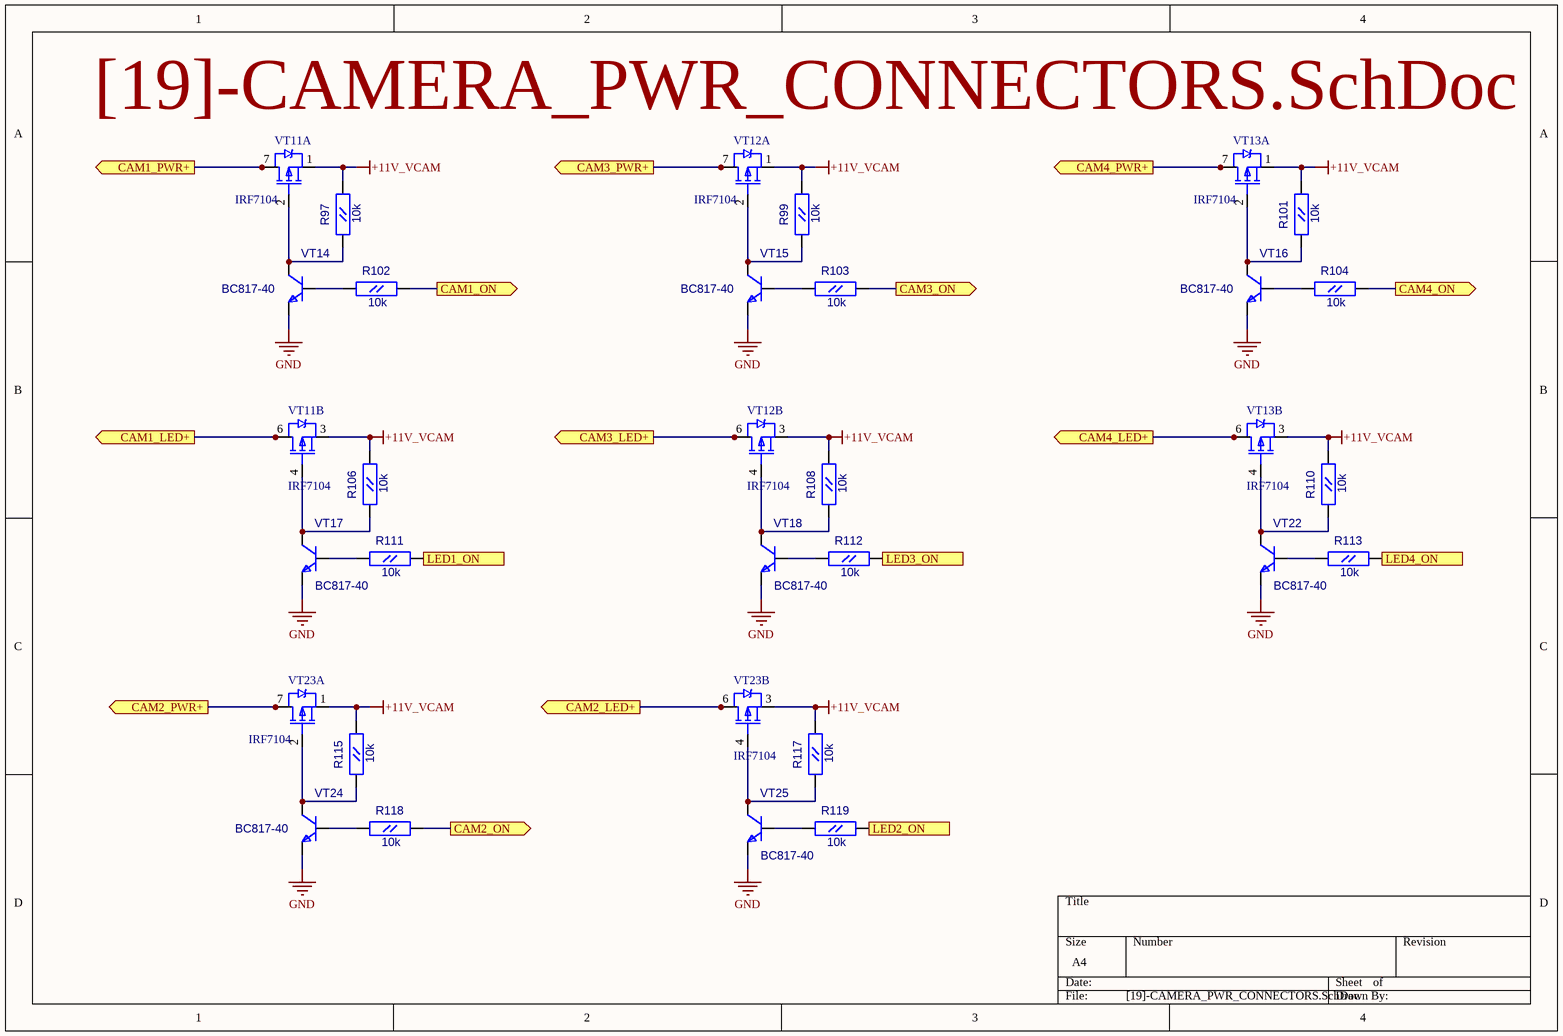
[diagram p6: [19]-CAMERA_PWR_CONNECTORS.SchDoc]

### Parts
R97  10k  [RC0603]
R99  10k  [RC0603]
R101  10k  [RC0603]
R102  10k  [RC0603]
R103  10k  [RC0603]
R104  10k  [RC0603]
R106  10k  [RC0603]
R108  10k  [RC0603]
R110  10k  [RC0603]
R111  10k  [RC0603]
R112  10k  [RC0603]
R113  10k  [RC0603]
R115  10k  [RC0603]
R117  10k  [RC0603]
R118  10k  [RC0603]
R119  10k  [RC0603]
VT11  IRF7104  [SO-8]  (parts A,B of 2)
VT12  IRF7104  [SO-8]  (parts A,B of 2)
VT13  IRF7104  [SO-8]  (parts A,B of 2)
VT14  BC817-40  [SOT-23(123)]
VT15  BC817-40  [SOT-23(123)]
VT16  BC817-40  [SOT-23(123)]
VT17  BC817-40  [SOT-23(123)]
VT18  BC817-40  [SOT-23(123)]
VT22  BC817-40  [SOT-23(123)]
VT23  IRF7104  [SO-8]  (parts A,B of 2)
VT24  BC817-40  [SOT-23(123)]
VT25  BC817-40  [SOT-23(123)]

### Ports
CAM1_LED+ (out), CAM1_ON (out), CAM1_PWR+ (out), CAM2_LED+ (out), CAM2_ON (out), CAM2_PWR+ (out), CAM3_LED+ (out), CAM3_ON (out), CAM3_PWR+ (out), CAM4_LED+ (out), CAM4_ON (out), CAM4_PWR+ (out), LED1_ON (out), LED2_ON (out), LED3_ON (out), LED4_ON (out)

### Nets
+11V_VCAM: R97.2(B) R99.2(B) R101.2(B) R106.2(B) R108.2(B) R110.2(B) R115.2(B) R117.2(B) VT11.1(S) VT11.3(S) VT12.1(S) VT12.3(S) VT13.1(S) VT13.3(S) VT23.1(S) VT23.3(S)
GND: VT14.2(E) VT15.2(E) VT16.2(E) VT17.2(E) VT18.2(E) VT22.2(E) VT24.2(E) VT25.2(E)
CAM1_ON: R102.2(B) ; port CAM1_ON
CAM2_ON: R118.2(B) ; port CAM2_ON
CAM3_ON: R103.2(B) ; port CAM3_ON
CAM4_ON: R104.2(B) ; port CAM4_ON
LED1_ON: R111.2(B) ; port LED1_ON
LED2_ON: R119.2(B) ; port LED2_ON
LED3_ON: R112.2(B) ; port LED3_ON
LED4_ON: R113.2(B) ; port LED4_ON
NetR97_1: R97.1(A) VT11.2(G) VT14.3(C)
NetR99_1: R99.1(A) VT12.2(G) VT15.3(C)
NetR101_1: R101.1(A) VT13.2(G) VT16.3(C)
NetR102_1: R102.1(A) VT14.1(B)
NetR103_1: R103.1(A) VT15.1(B)
NetR104_1: R104.1(A) VT16.1(B)
NetR106_1: R106.1(A) VT11.4(G) VT17.3(C)
NetR108_1: R108.1(A) VT12.4(G) VT18.3(C)
NetR110_1: R110.1(A) VT13.4(G) VT22.3(C)
NetR111_1: R111.1(A) VT17.1(B)
NetR112_1: R112.1(A) VT18.1(B)
NetR113_1: R113.1(A) VT22.1(B)
NetR115_1: R115.1(A) VT23.2(G) VT24.3(C)
NetR117_1: R117.1(A) VT23.4(G) VT25.3(C)
NetR118_1: R118.1(A) VT24.1(B)
NetR119_1: R119.1(A) VT25.1(B)
NetVT11_5: VT11.5 VT11.6(D) ; port CAM1_LED+
NetVT11_7: VT11.7(D) VT11.8 ; port CAM1_PWR+
NetVT12_5: VT12.5 VT12.6(D) ; port CAM3_LED+
NetVT12_7: VT12.7(D) VT12.8 ; port CAM3_PWR+
NetVT13_5: VT13.5 VT13.6(D) ; port CAM4_LED+
NetVT13_7: VT13.7(D) VT13.8 ; port CAM4_PWR+
NetVT23_5: VT23.5 VT23.6(D) ; port CAM2_LED+
NetVT23_7: VT23.7(D) VT23.8 ; port CAM2_PWR+

### Library data of the parts
R97 R99 R101-R104 R106 R108 R110-R113 R115 R117-R119 = RC0603: Value: 10k
VT11-VT13 VT23 = IRF7104: Dual P-channel MOSFET. 20V,2.3A, 0.25Ohm; Value: IRF7104
VT14-VT18 VT22 VT24 VT25 = BC846BLT1: as VT21 on sheet [10]-MODEM_CONNECTORS; OriginalName: BC846BLT1; Value: BC817-40

## Nets that join several sheets
+3V3: [3]-MCU_MAIN (11 pins), [10]-MODEM_CONNECTORS (C83.1 DD5.14 R74.1 R77.2), [16]-ETH_SWITCH (L4.1)
+11V_VCAM: [12]-CAMERA_POWER (VD8.2 VT7.2), [19]-CAMERA_PWR_CONNECTORS (16 pins)
GND: [3]-MCU_MAIN (14 pins), [6]-H3_MAIN (12 pins), [10]-MODEM_CONNECTORS (12 pins), [12]-CAMERA_POWER (15 pins), [16]-ETH_SWITCH (20 pins), [17]-ETH_CONNECTOR (20 pins), [19]-CAMERA_PWR_CONNECTORS (8 pins)
CAM0_LED: [6]-H3_MAIN (M1.15), [17]-ETH_CONNECTOR (R64.2)
CAM1_LED: [6]-H3_MAIN (M1.17), [17]-ETH_CONNECTOR (R95.2)
CAM1_ON: [3]-MCU_MAIN (DD1.10), [19]-CAMERA_PWR_CONNECTORS (R102.2)
CAM2_LED: [6]-H3_MAIN (M1.19), [17]-ETH_CONNECTOR (R63.2)
CAM2_ON: [3]-MCU_MAIN (DD1.13), [19]-CAMERA_PWR_CONNECTORS (R118.2)
CAM3_LED: [6]-H3_MAIN (M1.21), [17]-ETH_CONNECTOR (R94.2)
CAM3_ON: [3]-MCU_MAIN (DD1.15), [19]-CAMERA_PWR_CONNECTORS (R103.2)
CAM4_ON: [3]-MCU_MAIN (DD1.16), [19]-CAMERA_PWR_CONNECTORS (R104.2)
CSSIM: [6]-H3_MAIN (M1.57), [10]-MODEM_CONNECTORS (DD5.5 R80.2)
INPUT_0: [3]-MCU_MAIN (DD1.25), [6]-H3_MAIN (M1.60)
LED1_ON: [6]-H3_MAIN (M1.63), [19]-CAMERA_PWR_CONNECTORS (R111.2)
LED2_ON: [6]-H3_MAIN (M1.65), [19]-CAMERA_PWR_CONNECTORS (R119.2)
LED3_ON: [6]-H3_MAIN (M1.67), [19]-CAMERA_PWR_CONNECTORS (R112.2)
LED4_ON: [6]-H3_MAIN (M1.68), [19]-CAMERA_PWR_CONNECTORS (R113.2)
MCU_RXD: [3]-MCU_MAIN (DD1.46), [6]-H3_MAIN (M1.55)
MCU_TXD: [3]-MCU_MAIN (DD1.47), [6]-H3_MAIN (M1.66)
NetDD4_2: [16]-ETH_SWITCH (DD4.2), [17]-ETH_CONNECTOR (TR2.15)
NetDD4_3: [16]-ETH_SWITCH (DD4.3), [17]-ETH_CONNECTOR (TR2.13)
NetDD4_4: [16]-ETH_SWITCH (DD4.4), [17]-ETH_CONNECTOR (TR2.16)
NetDD4_5: [16]-ETH_SWITCH (DD4.5), [17]-ETH_CONNECTOR (TR2.18)
NetDD4_9: [16]-ETH_SWITCH (DD4.9), [17]-ETH_CONNECTOR (TR1.24)
NetDD4_10: [16]-ETH_SWITCH (DD4.10), [17]-ETH_CONNECTOR (TR1.22)
NetDD4_11: [16]-ETH_SWITCH (DD4.11), [17]-ETH_CONNECTOR (TR1.19)
NetDD4_12: [16]-ETH_SWITCH (DD4.12), [17]-ETH_CONNECTOR (TR1.21)
NetDD4_14: [16]-ETH_SWITCH (DD4.14), [17]-ETH_CONNECTOR (TR1.15)
NetDD4_15: [16]-ETH_SWITCH (DD4.15), [17]-ETH_CONNECTOR (TR1.13)
NetDD4_16: [16]-ETH_SWITCH (DD4.16), [17]-ETH_CONNECTOR (TR1.16)
NetDD4_17: [16]-ETH_SWITCH (DD4.17), [17]-ETH_CONNECTOR (TR1.18)
NetDD4_19: [6]-H3_MAIN (M1.27), [16]-ETH_SWITCH (DD4.19)
NetDD4_20: [6]-H3_MAIN (M1.28), [16]-ETH_SWITCH (DD4.20)
NetDD4_21: [6]-H3_MAIN (M1.30), [16]-ETH_SWITCH (DD4.21)
NetDD4_22: [6]-H3_MAIN (M1.29), [16]-ETH_SWITCH (DD4.22)
NetDD4_29: [16]-ETH_SWITCH (DD4.29), [17]-ETH_CONNECTOR (R58.2)
NetDD4_30: [16]-ETH_SWITCH (DD4.30), [17]-ETH_CONNECTOR (R72.2)
NetDD4_32: [16]-ETH_SWITCH (DD4.32), [17]-ETH_CONNECTOR (R57.2)
NetDD4_33: [16]-ETH_SWITCH (DD4.33), [17]-ETH_CONNECTOR (R71.2)
NetDD4_44: [16]-ETH_SWITCH (DD4.44), [17]-ETH_CONNECTOR (TR2.21)
NetDD4_45: [16]-ETH_SWITCH (DD4.45), [17]-ETH_CONNECTOR (TR2.19)
NetDD4_46: [16]-ETH_SWITCH (DD4.46), [17]-ETH_CONNECTOR (TR2.22)
NetDD4_47: [16]-ETH_SWITCH (DD4.47), [17]-ETH_CONNECTOR (TR2.24)
NetVT11_5: [17]-ETH_CONNECTOR (XP8.5A), [19]-CAMERA_PWR_CONNECTORS (VT11.5 VT11.6)
NetVT11_7: [17]-ETH_CONNECTOR (XP8.4A), [19]-CAMERA_PWR_CONNECTORS (VT11.7 VT11.8)
NetVT12_5: [17]-ETH_CONNECTOR (XP8.5C), [19]-CAMERA_PWR_CONNECTORS (VT12.5 VT12.6)
NetVT12_7: [17]-ETH_CONNECTOR (XP8.4C), [19]-CAMERA_PWR_CONNECTORS (VT12.7 VT12.8)
NetVT13_5: [17]-ETH_CONNECTOR (XP8.5D), [19]-CAMERA_PWR_CONNECTORS (VT13.5 VT13.6)
NetVT13_7: [17]-ETH_CONNECTOR (XP8.4D), [19]-CAMERA_PWR_CONNECTORS (VT13.7 VT13.8)
NetVT23_5: [17]-ETH_CONNECTOR (XP8.5B), [19]-CAMERA_PWR_CONNECTORS (VT23.5 VT23.6)
NetVT23_7: [17]-ETH_CONNECTOR (XP8.4B), [19]-CAMERA_PWR_CONNECTORS (VT23.7 VT23.8)
SIM_OUT: [6]-H3_MAIN (M1.51), [10]-MODEM_CONNECTORS (R74.2 XP4.8)